# Altium schematic sheet Breakouts.SchDoc: Breakouts and Testpoints
size A; DocumentNumber: 8; SheetNumber: 8; SheetTotal: 9
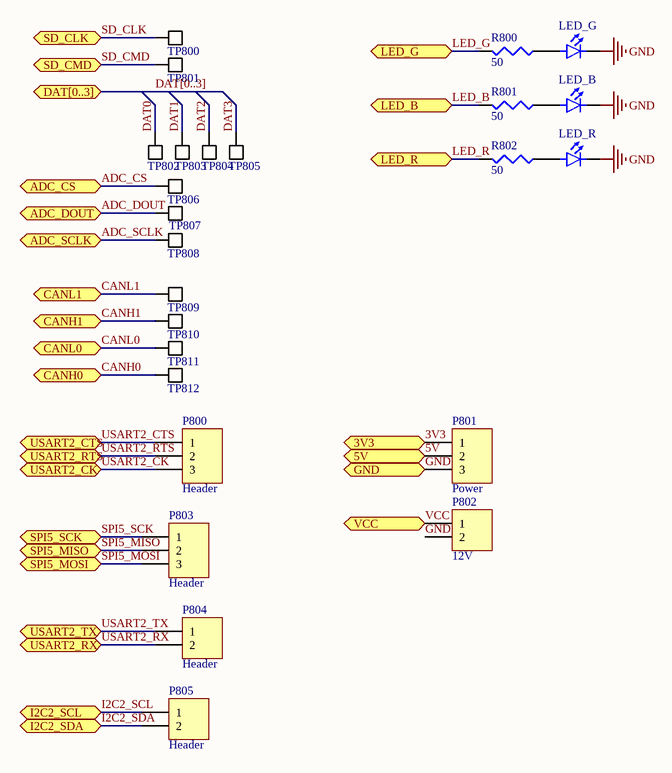
[diagram p0: Breakouts.SchDoc]

## Parts
LED_B  LED  [SMD0603 POLARIZED]  (value not drawn)
LED_G  LED  [SMD0603 POLARIZED]  (value not drawn)
LED_R  LED  [SMD0603 POLARIZED]  (value not drawn)
P800  Header  [HEADER 3X1]
P801  Power  [HEADER 3X1]
P802  12V  [Header 2x1]
P803  Header  [HEADER 3X1]
P804  Header  [Header 2x1]
P805  Header  [Header 2x1]
R800  value 50  [SMD0603]  (hidden comment: Res)
R801  value 50  [SMD0603]  (hidden comment: Res)
R802  value 50  [SMD0603]  (hidden comment: Res)
TP800  Test Point  [Test Point]  (value not drawn)
TP801  Test Point  [Test Point]  (value not drawn)
TP802  Test Point  [Test Point]  (value not drawn)
TP803  Test Point  [Test Point]  (value not drawn)
TP804  Test Point  [Test Point]  (value not drawn)
TP805  Test Point  [Test Point]  (value not drawn)
TP806  Test Point  [Test Point]  (value not drawn)
TP807  Test Point  [Test Point]  (value not drawn)
TP808  Test Point  [Test Point]  (value not drawn)
TP809  Test Point  [Test Point]  (value not drawn)
TP810  Test Point  [Test Point]  (value not drawn)
TP811  Test Point  [Test Point]  (value not drawn)
TP812  Test Point  [Test Point]  (value not drawn)

## Ports
3V3, 5V, ADC_CS, ADC_DOUT, ADC_SCLK, CANH0, CANH1, CANL0, CANL1, DAT[0..3], GND, I2C2_SCL, I2C2_SDA, LED_B, LED_G, LED_R, SD_CLK, SD_CMD, SPI5_MISO, SPI5_MOSI, SPI5_SCK, USART2_CK, USART2_CTS, USART2_RTS, USART2_RX, USART2_TX, VCC

## Nets
GND: LED_B.2(Cathode_(-)) LED_G.2(Cathode_(-)) LED_R.2(Cathode_(-)) P801.3 P802.2 ; port GND
3V3: P801.1 ; port 3V3
5V: P801.2 ; port 5V
ADC_CS: TP806.1 ; port ADC_CS
ADC_DOUT: TP807.1 ; port ADC_DOUT
ADC_SCLK: TP808.1 ; port ADC_SCLK
CANH0: TP812.1 ; port CANH0
CANH1: TP810.1 ; port CANH1
CANL0: TP811.1 ; port CANL0
CANL1: TP809.1 ; port CANL1
DAT0: TP802.1
DAT1: TP803.1
DAT2: TP804.1
DAT3: TP805.1
I2C2_SCL: P805.1 ; port I2C2_SCL
I2C2_SDA: P805.2 ; port I2C2_SDA
LED_B: R801.2 ; port LED_B
LED_G: R800.2 ; port LED_G
LED_R: R802.2 ; port LED_R
SD_CLK: TP800.1 ; port SD_CLK
SD_CMD: TP801.1 ; port SD_CMD
SPI5_MISO: P803.2 ; port SPI5_MISO
SPI5_MOSI: P803.3 ; port SPI5_MOSI
SPI5_SCK: P803.1 ; port SPI5_SCK
USART2_CK: P800.3 ; port USART2_CK
USART2_CTS: P800.1 ; port USART2_CTS
USART2_RTS: P800.2 ; port USART2_RTS
USART2_RX: P804.2 ; port USART2_RX
USART2_TX: P804.1 ; port USART2_TX
VCC: P802.1 ; port VCC
NetLED_B_1: LED_B.1(Anode_(+)) R801.1
NetLED_G_1: LED_G.1(Anode_(+)) R800.1
NetLED_R_1: LED_R.1(Anode_(+)) R802.1

## Buses and harness runs
bus DAT[0..3] = port DAT[0..3]

## Library data of the parts
P800 P801 P803 = Header 3x1: Header, 2-Pin
P802 P804 P805 = Header 2x1: Header, 2-Pin
R800-R802 = Resistor
TP800-TP812 = Test Point: Supplier 1: Digi-Key; Supplier Part Number 1: 5019KCT-ND